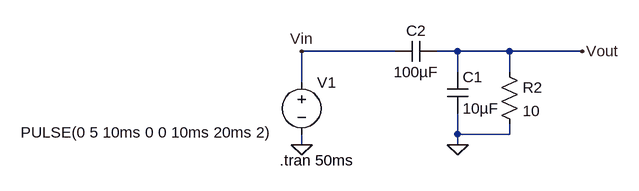
[diagram p0: schematic RC-Circuits-A1_2.asc]
RC-Circuits-A1_2.asc, the LTspice schematic file:
Version 4
SHEET 1 880 680
WIRE 160 80 16 80
WIRE 256 80 224 80
WIRE 336 80 256 80
WIRE 448 80 336 80
WIRE 256 112 256 80
WIRE 336 112 336 80
WIRE 16 128 16 80
WIRE 256 208 256 176
WIRE 336 208 336 192
WIRE 336 208 256 208
WIRE 16 224 16 208
WIRE 256 224 256 208
FLAG 16 224 0
FLAG 256 224 0
FLAG 448 80 Vout
FLAG 16 80 Vin
SYMBOL voltage 16 112 R0
WINDOW 3 -432 93 Left 2
WINDOW 123 0 0 Left 0
WINDOW 39 0 0 Left 0
SYMATTR InstName V1
SYMATTR Value PULSE(0 5 10ms 0 0 10ms 20ms 2)
SYMBOL cap 240 112 R0
SYMATTR InstName C1
SYMATTR Value 10µF
SYMBOL res 320 96 R0
SYMATTR InstName R2
SYMATTR Value 10
SYMBOL cap 224 64 R90
WINDOW 0 0 32 VBottom 2
WINDOW 3 32 32 VTop 2
SYMATTR InstName C2
SYMATTR Value 100µF
TEXT -18 248 Left 2 !.tran 50ms

The netlist it stands for:
* RC-Circuits-A1_2.asc
V1 Vin 0 PULSE(0 5 10ms 0 0 10ms 20ms 2)
C1 Vout 0 10µF
R2 Vout 0 10
C2 Vout Vin 100µF
.tran 50ms
.backanno
.end